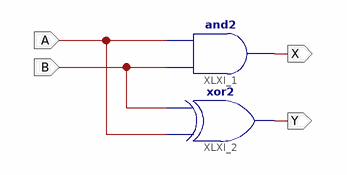
[diagram p0: schematic sheet 1]
// Xilinx ISE schematic HalfAdder.sch (spartan6) as structural Verilog: 2 symbols, 4 ports
module HalfAdder (
  input  A,
  input  B,
  output X,
  output Y
);

  and XLXI_1 (X, B, A);
  xor XLXI_2 (Y, A, B);
endmodule
